# EAGLE design Sony PSP USB-C (EAGLE 6.2)
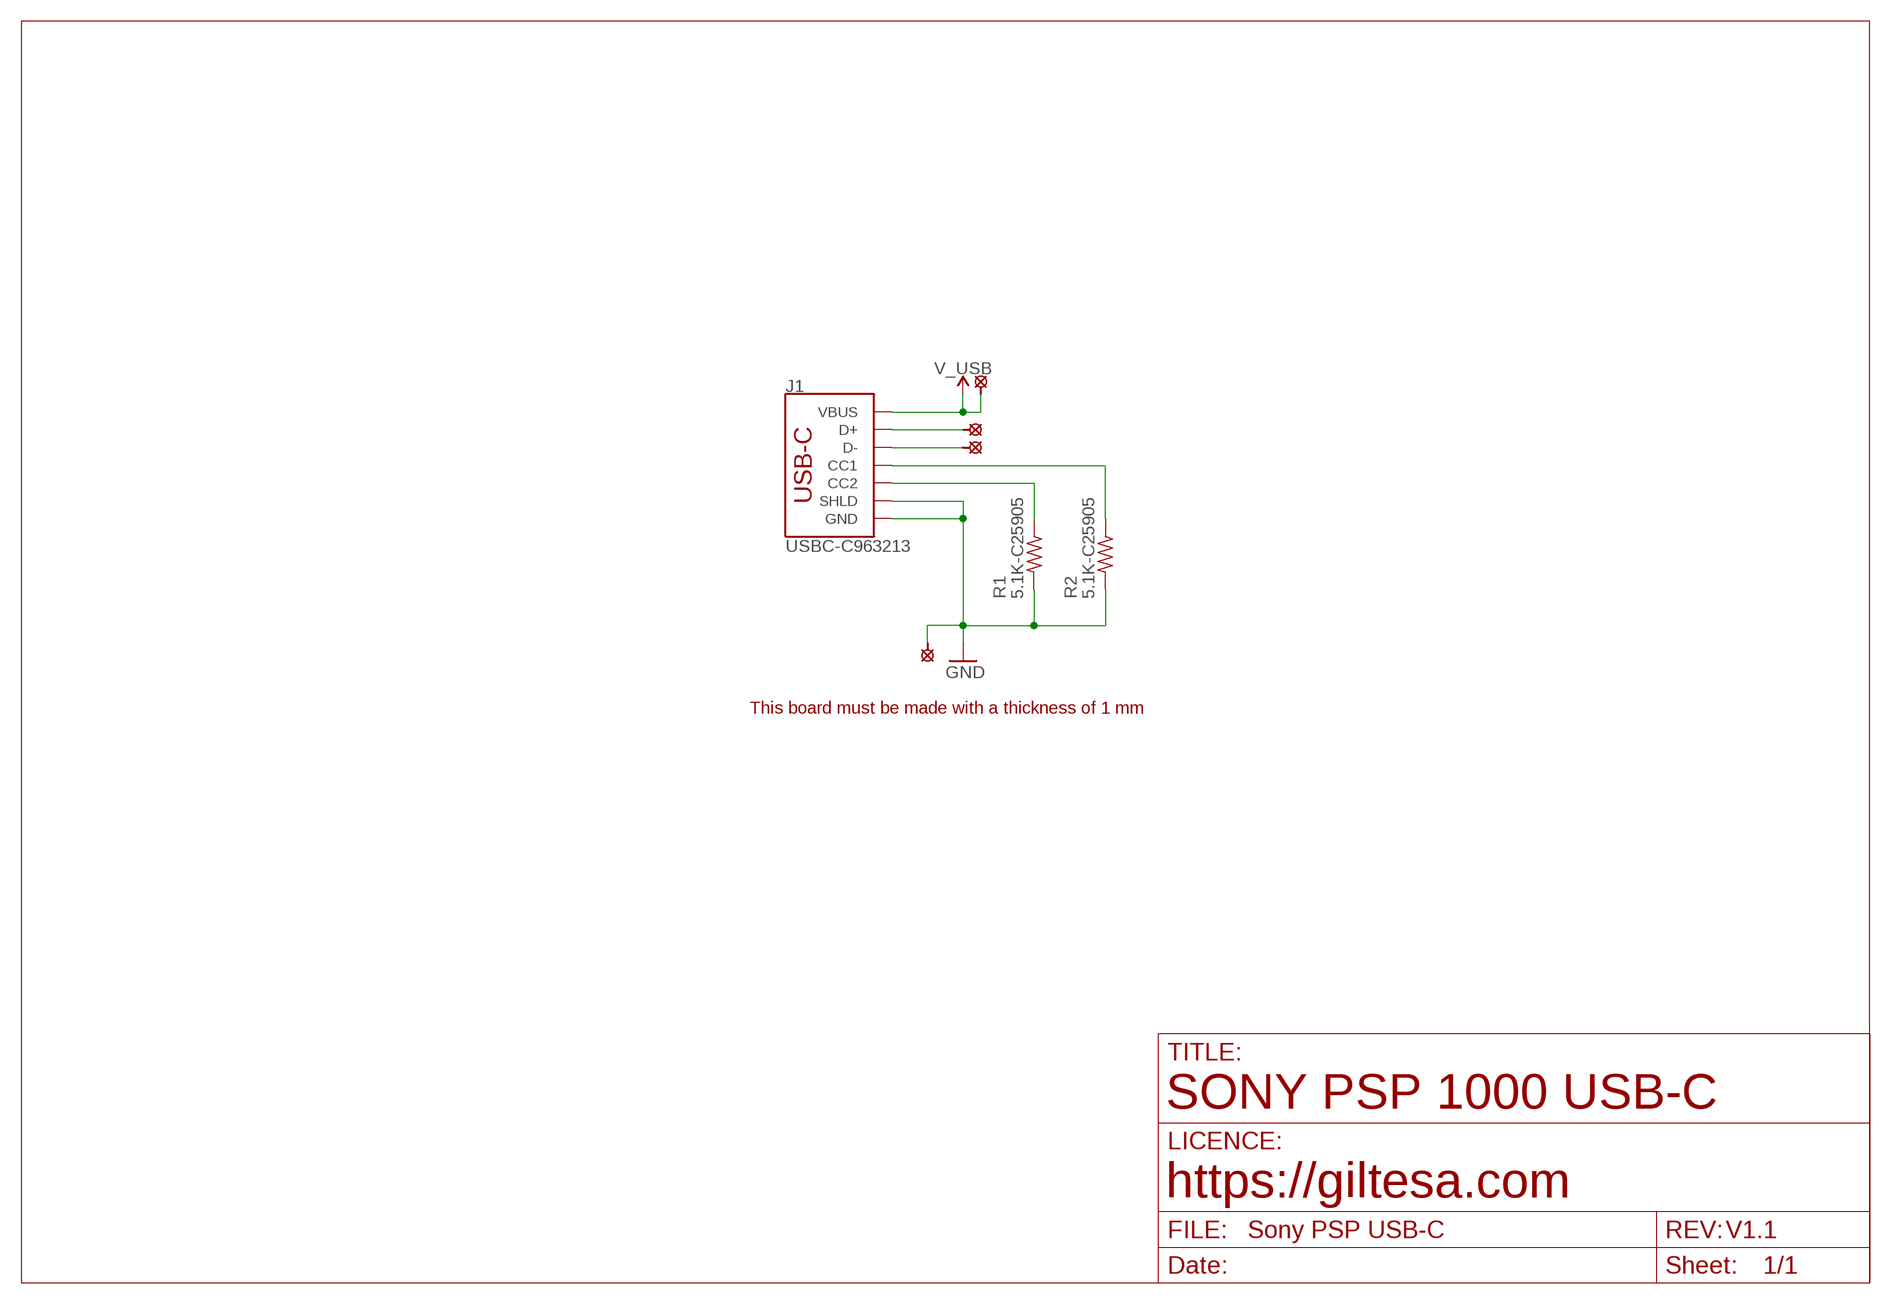
[diagram p0: schematic, sheet 1]

## Parts
J1  USBC-C963213  USB-C_16P_DATA_SLIM  [USB-C_18P_SLIM_GT-USB-7025]
R1  5.1K-C25905  R0402  [R0402]
R2  5.1K-C25905  R0402  [R0402]
U$1  SOLDER_PAD_PSP_1000  [PSP_1000_PAD]
U$3  SOLDER_PAD_PSP_1000  [PSP_1000_PAD]
U$5  SOLDER_PAD-1.2  [SOLDER_PAD_1.2]
U$6  SOLDER_PAD-1.2  [SOLDER_PAD_1.2]

## Nets
CC1: J1.A5-CC1(CC1) R2.1
CC2: J1.B5-CC2(CC2) R1.1
D+: J1.A6-DP1(D+) J1.B6-DP2(D+) U$5.P$1
D-: J1.A7-DN1(D-) J1.B7-DN2(D-) U$6.P$1
GND: J1.A1-GND(GND) J1.A12-GND(GND) J1.B1-GND(GND) J1.B12-GND(GND) J1.GND1(GND) J1.GND2(GND) J1.SHLD1(SHLD) J1.SHLD2(SHLD) J1.SHLD3(SHLD) J1.SHLD4(SHLD) R1.2 R2.2 U$1.1
V_USB: J1.A4-VBUS(VBUS) J1.A9-VBUS(VBUS) J1.B4-VBUS(VBUS) J1.B9-VBUS(VBUS) U$3.1

## Notes on the sheet
- This board must be made with a thickness of 1 mm
- SONY PSP 1000 USB-C
- https://giltesa.com
- V1.1

## Library data of the parts
J1 = ,giltesa:USB-C_16P
R1 R2 = ,giltesa:R0402
U$1 U$3 U$5 U$6 = ,giltesa:SOLDER_PAD

## Net classes
1 power: width 0.61 mm, drill 0.406 mm, clearance 0.203 mm
2 gnd: width 0.305 mm, drill 0.406 mm, clearance 0.203 mm
3 power usb: width 0.508 mm, drill 0.406 mm, clearance 0.203 mm

## Board
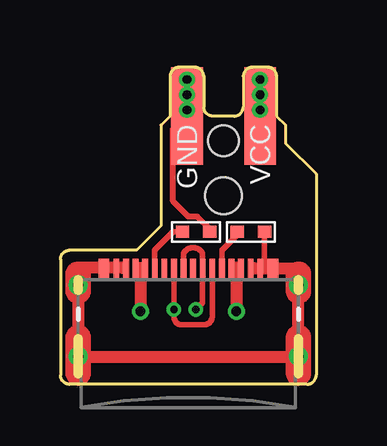
[diagram p1: board, top side]
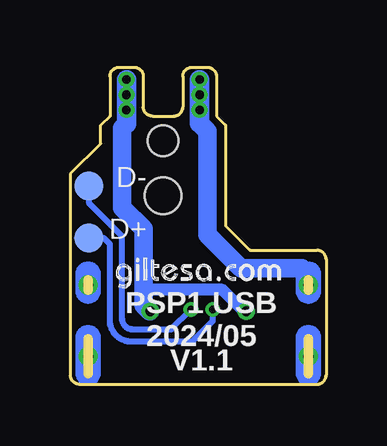
[diagram p2: board, bottom side, seen from below]

Size 10.67 x 13.21 mm. Coordinates in mm from the lower left corner, seen from the top.
Outline: 3.17,5.59 0.38,5.59 arc90 0,5.21 0,0.38 arc90 0.38,0 10.29,0 arc90 10.67,0.38 10.67,8.76 9.4,10.03 9.4,10.79 9.02,11.18 9.02,12.83 arc90 8.64,13.21 8.01,13.21 arc90 7.63,12.83 7.63,11.56 arc-90 7.24,11.18 6.35,11.18 arc-90 5.98,11.56 5.98,12.83 arc90 5.6,13.21 4.96,13.21 arc90 4.57,12.83 4.57,11.18 4.19,10.79 4.19,6.6 3.17,5.59
Copper layers (1*16): Top 0.035mm / dielectric 1.6mm / Bottom 0.035mm
Design rules: minimum track width 6mil, minimum drill 12mil, track to track 6mil, track to pad 6mil, pad to pad 6mil, via to via 8mil, smd to smd 0mil, copper to edge 20mil, drill to drill 10mil, minimum pad ring 6mil, minimum via ring 6mil, stop-mask expansion 0mil, vias tented up to drill 100mil, thermal gap 10mil
Holes 1.52 mm at 6.8,7.85
Holes 1.27 mm at 6.8,10.14

### Footprints (pad centres in the part's own frame; a part is rotated, then mirrored left to right if it is on the bottom)
USB-C_18P_SLIM_GT-USB-7025 = smd 0.24 x 0.8: A1-GND -3,1.845; A4-VBUS -2.2,1.845; A5-CC1 -1.4,1.845; A6-DP1 -0.6,1.845; A7-DN1 -0.2,1.845; A8-SBU1 0.2,1.845; A9-VBUS 1.8,1.845; A12-GND 2.6,1.845; B1-GND 3,1.845; B4-VBUS 2.2,1.845; B5-CC2 1.4,1.845; B6-DP2 1,1.845; B7-DN2 0.6,1.845; B8-SBU2 -1,1.845; B9-VBUS -1.8,1.845; B12-GND -2.6,1.845 | smd 0.45 x 0.8: GND1 -3.525,1.845; GND2 3.525,1.845 | drill 0.4 pad 0.8: SHLD1 -4.595,1.155; SHLD2 4.595,1.155; SHLD3 -4.595,-1.815; SHLD4 4.595,-1.815
R0402 = smd 0.559 x 0.5: 1 -0.567,0; 2 0.567,0
PSP_1000_PAD = smd 1.321 x 4.064: 1 0,0
SOLDER_PAD_1.2 = smd 1.2 x 1.2: P$1 0,0

### Placement (x,y rotation side)
J1  5.33,2.98 0 top
R1  7.95,6.35 0 top
R2  5.66,6.35 0 top
U$1  5.28,11.18 0 top
U$3  8.33,11.18 0 top
U$5  9.91,6.1 0 bottom
U$6  9.91,8.26 0 bottom
U$11  [GILTESA.COM_MASK_7MM]  8.81,3.94 0 bottom

### Tracks (layer width: path | path; a pad name or v marks a point on that pad's centre or on a via)
CC1
  Top 0.229: J1.A5-CC1 3.93,5.59 4.7,6.35 R2.1
CC2
  Top 0.203: J1.B5-CC2 6.73,4.7
  Top 0.229: 6.73,4.7 6.73,4.84 arc-90 6.73,4.84 | J1.B5-CC2 6.73,5.59 7.38,6.24 R1.1
D+  (via drill 0.3)
  Top 0.229: 4.73,4.84 J1.A6-DP1 v4.73,3.11 4.73,2.82 arc90 5.08,2.48 5.97,2.48 arc90 6.33,2.84 J1.B6-DP2 6.33,4.84
  Bottom 0.254: v4.73,3.11 4.73,2.63 5.59,1.78 8.13,1.78 arc90 9.02,2.67 9.02,5.84 9.27,6.1 U$5.P$1
D-  (via drill 0.3)
  Top 0.229: J1.A7-DN1 5.13,5.46 arc-120 5.93,5.46 J1.B7-DN2 5.93,3.41 v5.64,3.11
  Bottom 0.254: v5.64,3.11 6.46,2.29 8.06,2.29 arc90 8.51,2.73 8.51,6.17 9.91,7.57 U$6.P$1
GND  (via drill 0.36)
  Top 0.203: 7.93,4.84 8,4.84 | 8,4.84 8.08,4.84 | 2.73,4.84 2.73,4.86 2.59,4.85 | 2.33,4.84 1.81,4.84 J1.GND1 | 2.33,4.85 2.33,4.84 | J1.B12-GND J1.A1-GND 2.33,4.84 | J1.B1-GND J1.A12-GND 8,4.83 8,4.84 | J1.GND2 8.89,4.83 8.89,4.84
  Top 0.229: R1.2 8.51,5.17 J1.GND2
  Top 0.254: R2.2 6.23,6.47 5.71,6.98 5.33,6.98 4.7,7.62 4.7,10.67 4.95,10.92 4.95,10.85 U$1.1
  Top 0.508: 8.08,4.84 8.89,4.84 9.86,4.84 9.93,4.77 J1.SHLD2 J1.SHLD4 9.93,1.14 1.02,1.14 | 2.59,4.85 2.33,4.85 0.74,4.85 J1.SHLD1 J1.SHLD3 | J1.SHLD3 0.74,1.14 1.02,1.14 | J1.SHLD3 1.02,1.17 1.02,1.14
  Top 0.762: U$1.1 5.02,11.18 5.28,10.79
  Top 0.914: 5.28,10.79 U$1.1 v5.28,12.07
  Bottom 0.762: J1.SHLD1 0.74,4.55 1.02,4.83 3.56,4.83 4.95,6.22 4.95,10.54 5.28,10.87
  Bottom 0.813: 5.28,10.87 v5.28,11.43 v5.28,12.07 v5.28,12.7
N$1
  Top 0.254: 10.17,0.94 9.93,1.18
V_USB  (via drill 0.36, 0.41)
  Top 0.127: 3.33,4.91 3.51,4.99 | J1.B9-VBUS 3.53,4.84
  Top 0.203: 3.53,4.84 3.33,4.84 | 3.13,4.84 3.16,4.84 J1.A4-VBUS 3.17,4.82 | 3.36,4.82 3.17,4.82 | 7.53,4.84 7.34,4.84 7.13,4.84 7.13,4.89 7.23,4.99 7.43,4.99 | J1.B9-VBUS 3.36,4.82 | 3.36,4.82 3.33,4.8 | J1.B9-VBUS J1.A4-VBUS 3.17,4.83 3.17,4.82 | J1.B4-VBUS J1.A9-VBUS 7.34,4.83 7.34,4.7 | 3.19,4.99 3.51,4.99
  Top 0.254: 3.33,4.91 3.33,4.84
  Top 0.508: 3.33,4.8 v3.33,3.05 | 7.34,4.84 7.34,4.7 v7.34,3.05
  Top 0.762: U$3.1 8.58,11.18 8.33,10.79
  Top 0.914: 8.33,10.79 v8.33,12.07
  Bottom 0.508: v3.33,3.05 3.33,2.95 4.32,3.94 7.62,3.94
  Bottom 0.762: v7.34,3.05 7.37,3.05 7.62,3.3 7.62,3.94 7.62,6.48 8.51,7.37 8.51,10.67 8.33,10.85
  Bottom 0.813: 8.33,10.85 v8.33,11.43 v8.33,12.07 v8.33,12.7

### Text on the board
tPlace: GND | VCC
bPlace: D- | D+ | PSP1 USB | 2024/05 | V1.1